# EAGLE design ethero_v4 (EAGLE 6.4)
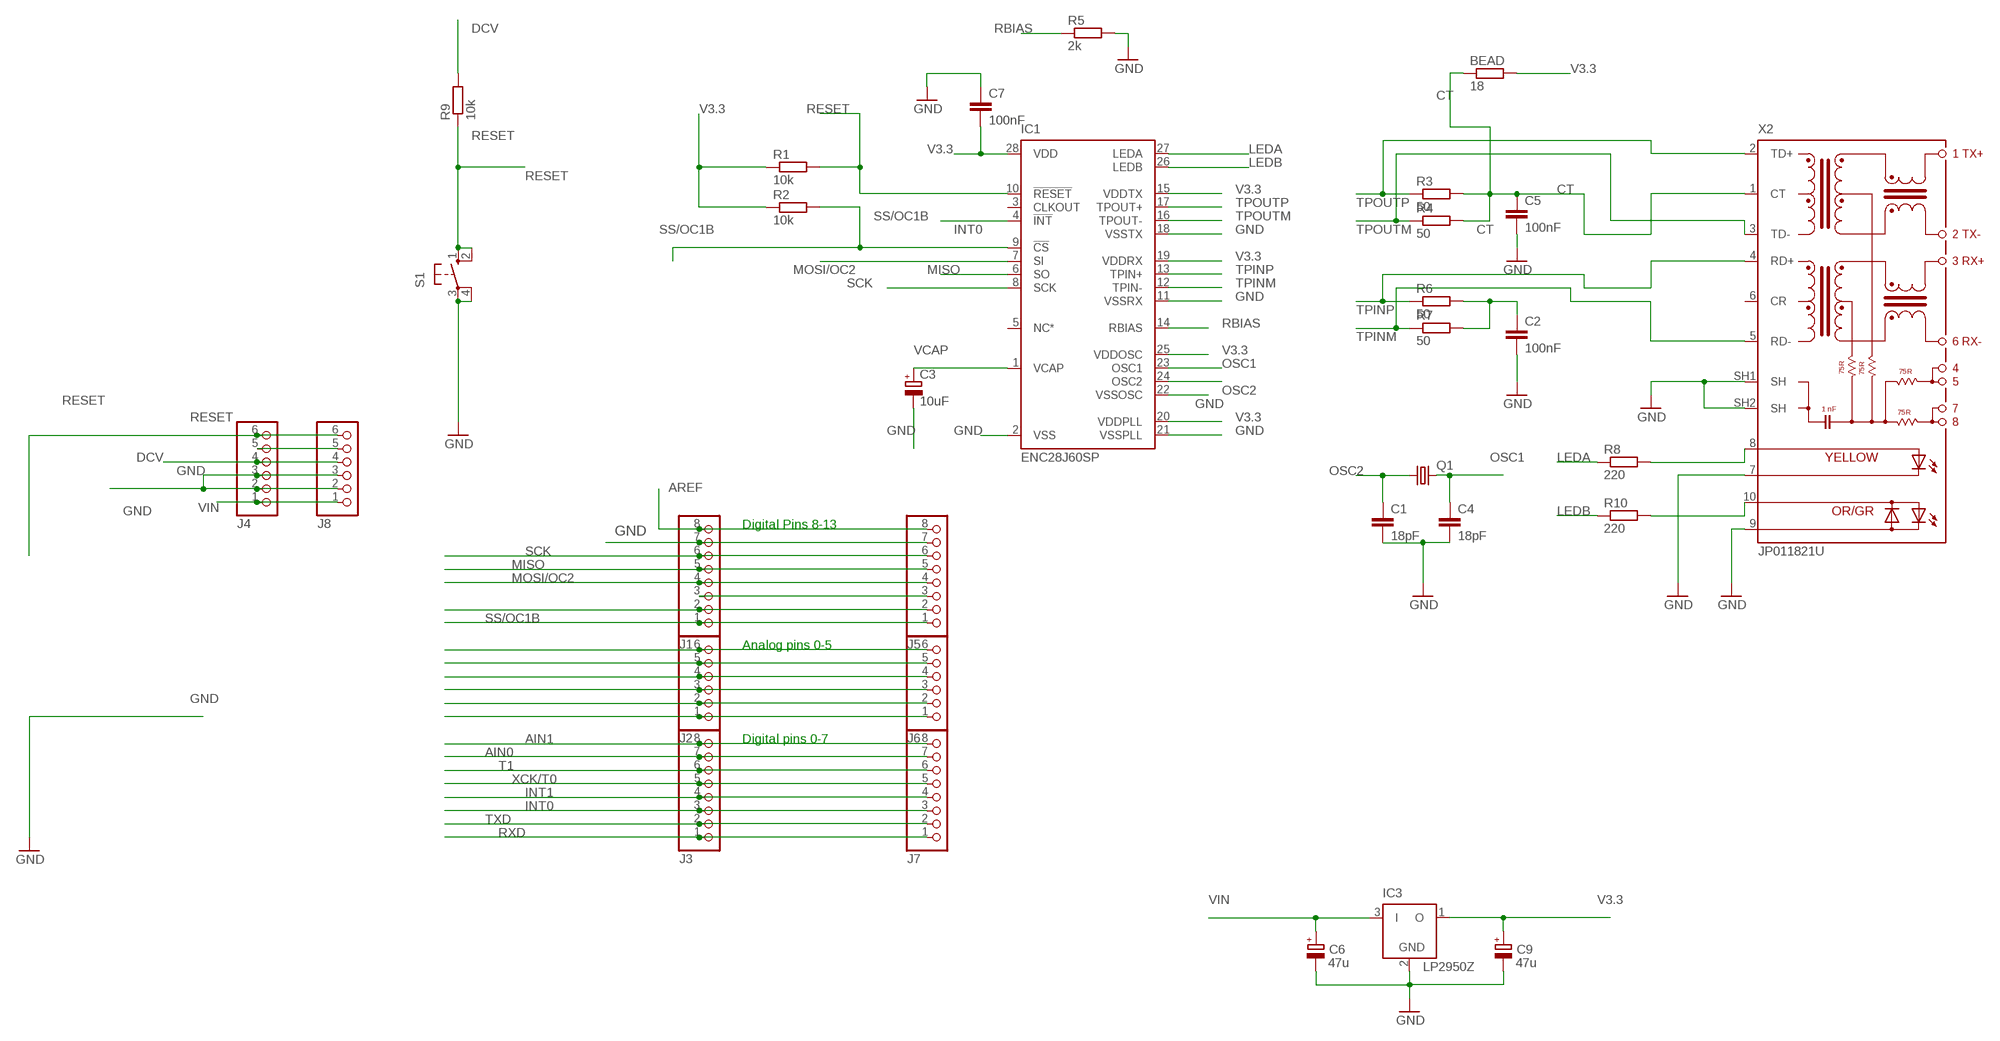
[diagram p0: schematic, sheet 1]

## Parts
BEAD  18  R-EU_0204/7  [0204/7]
C1  18pF  C-EU025-025X050  [C025-025X050]
C2  100nF  C-EU025-025X050  [C025-025X050]
C3  10uF  CPOL-EUE5-5  [E5-5]
C4  18pF  C-EU025-025X050  [C025-025X050]
C5  100nF  C-EU025-025X050  [C025-025X050]
C6  47u  CPOL-EUE3.5-8  [E3,5-8]
C7  100nF  C-EU025-025X050  [C025-025X050]
C9  47u  CPOL-EUE3.5-8  [E3,5-8]
IC1  ENC28J60SP  [DIL28-3]
IC3  LP2950Z  [TO92]
J1  PINHD-1X8  [1X08]
J2  PINHD-1X6  [1X06]
J3  PINHD-1X8  [1X08]
J4  PINHD-1X6  [1X06]
J5  PINHD-1X8  [1X08]
J6  PINHD-1X6  [1X06]
J7  PINHD-1X8  [1X08]
J8  PINHD-1X6  [1X06]
Q1  CRYSTALHC18U-V  [HC18U-V]
R1  10k  R-EU_0204/7  [0204/7]
R2  10k  R-EU_0204/7  [0204/7]
R3  50  R-EU_0204/7  [0204/7]
R4  50  R-EU_0204/7  [0204/7]
R5  2k  R-EU_0204/7  [0204/7]
R6  50  R-EU_0204/7  [0204/7]
R7  50  R-EU_0204/7  [0204/7]
R8  220  R-EU_0204/7  [0204/7]
R9  10k  R-EU_0204/7  [0204/7]
R10  220  R-EU_0204/7  [0204/7]
S1  10-XX  [B3F-10XX]
X2  JP011821U  [JP]

## Nets
AIN0: J3.7 J7.7
AIN1: J3.8 J7.8
AREF: J1.8 J5.8
CT: BEAD.1 C5.1 R3.2 R4.2 X2.1(CT)
DCV [power]: J4.4 J8.4 R9.2
GND [power]: C1.2 C2.2 C3.- C4.2 C5.2 C6.- C7.1 C9.- IC1.2(VSS) IC1.11(VSSRX) IC1.18(VSSTX) IC1.21(VSSPLL) IC1.22(VSSOSC) IC3.2(GND) J1.7 J4.2 J4.3 J5.7 J8.2 J8.3 R5.2 S1.3(P) S1.4(P1) X2.7(C-Y) X2.9(A-O_C-G) X2.SH1(SH) X2.SH2(SH)
INT0: IC1.4(!INT) J3.3 J7.3
INT1: J3.4 J7.4
LEDA: IC1.27(LEDA) R8.1
LEDB: IC1.26(LEDB) R10.1
MISO: IC1.6(SO) J1.5 J5.5
MOSI/OC2: IC1.7(SI) J1.4 J5.4
N$2: J1.2 J5.2
N$3: J4.5 J8.5
N$5: C2.1 R6.2 R7.2
N$6: J1.3 J5.3
N$10: R8.2 X2.8(A-Y)
N$12: R10.2 X2.10(C-O_A-G)
N$16: J2.1 J6.1
N$17: J2.2 J6.2
N$18: J2.3 J6.3
N$19: J2.4 J6.4
N$20: J2.5 J6.5
N$21: J2.6 J6.6
OSC1: C4.1 IC1.23(OSC1) Q1.2
OSC2: C1.1 IC1.24(OSC2) Q1.1
RBIAS: IC1.14(RBIAS) R5.1
RESET: IC1.10(!RESET) J4.6 J8.6 R1.2 R9.1 S1.1(S) S1.2(S1)
RXD: J3.1 J7.1
SCK: IC1.8(SCK) J1.6 J5.6
SS/OC1B: IC1.9(!CS) J1.1 J5.1 R2.2
T1: J3.6 J7.6
TPINM: IC1.12(TPIN-) R7.1 X2.5(RD-)
TPINP: IC1.13(TPIN+) R6.1 X2.4(RD+)
TPOUTM: IC1.16(TPOUT-) R4.1 X2.3(TD-)
TPOUTP: IC1.17(TPOUT+) R3.1 X2.2(TD+)
TXD: J3.2 J7.2
V3.3: BEAD.2 C7.2 C9.+ IC1.15(VDDTX) IC1.19(VDDRX) IC1.20(VDDPLL) IC1.25(VDDOSC) IC1.28(VDD) IC3.1(O) R1.1 R2.1
VCAP: C3.+ IC1.1(VCAP)
VIN [power]: C6.+ IC3.3(I) J4.1 J8.1
XCK/T0: J3.5 J7.5
Unconnected: IC1.3(CLKOUT) IC1.5(NC*) X2.6(CR)

## Notes on the sheet
- Digital Pins 8-13
- Analog pins 0-5
- Digital pins 0-7

## Library data of the parts
BEAD R1-R10 = resistor:R-EU_: RESISTOR, European symbol
C1 C2 C4 C5 C7 = resistor:C-EU: CAPACITOR, European symbol
C3 C6 C9 = rcl:CPOL-EU: POLARIZED CAPACITOR, European symbol
IC1 = microchip:ENC28J60: Stand-Alone Ethernet Controller with SPI Interface Source: http://ww1.microchip.com/downloads/en/DeviceDoc/39662c.pdf; MF: MICROCHIP; MPN: ENC28J60/SP; OC_FARNELL: 1084619; OC_NEWARK: 96K3661
IC3 = linear:LP2950: 100 mA, Low Power Low Dropout Voltage Regulator Source: http://www.onsemi.com/pub/Collateral/LP2950-D.PDF
J1 J3 J5 J7 = pinhead:PINHD-1X8: PIN HEADER
J2 J4 J6 J8 = pinhead:PINHD-1X6: PIN HEADER
Q1 = crystal:CRYSTAL: CRYSTAL; OC_FARNELL: unknown; OC_NEWARK: unknown
S1 = switch-omron:10-XX: OMRON SWITCH; MPN: B3F-1000; OC_FARNELL: 176432; OC_NEWARK: 36M3542
X2 = con-pulse:JP011821U: PULSEJACK (TM) 1x1 Tab-UP RJ45 10/100 Base-TX RJ45 1x1 Tab-UP with LEDs 8-pin (J1 series) and 6-pin (JP series) integrated magnetics connector, designed to support applications, such as ADSL modems, LAN-on-Motherboard, and Hub and Switches. Source: www.pulseeng.com .. PulseJack-J402.pdf; OC_FARNELL: unknown; OC_NEWARK: unknown

## Net classes
0 default: width 0.203 mm, clearance 0.203 mm
1 power: width 0.6 mm, clearance 0.305 mm
2 finepitch: width 0.203 mm, clearance 0.203 mm

## Board
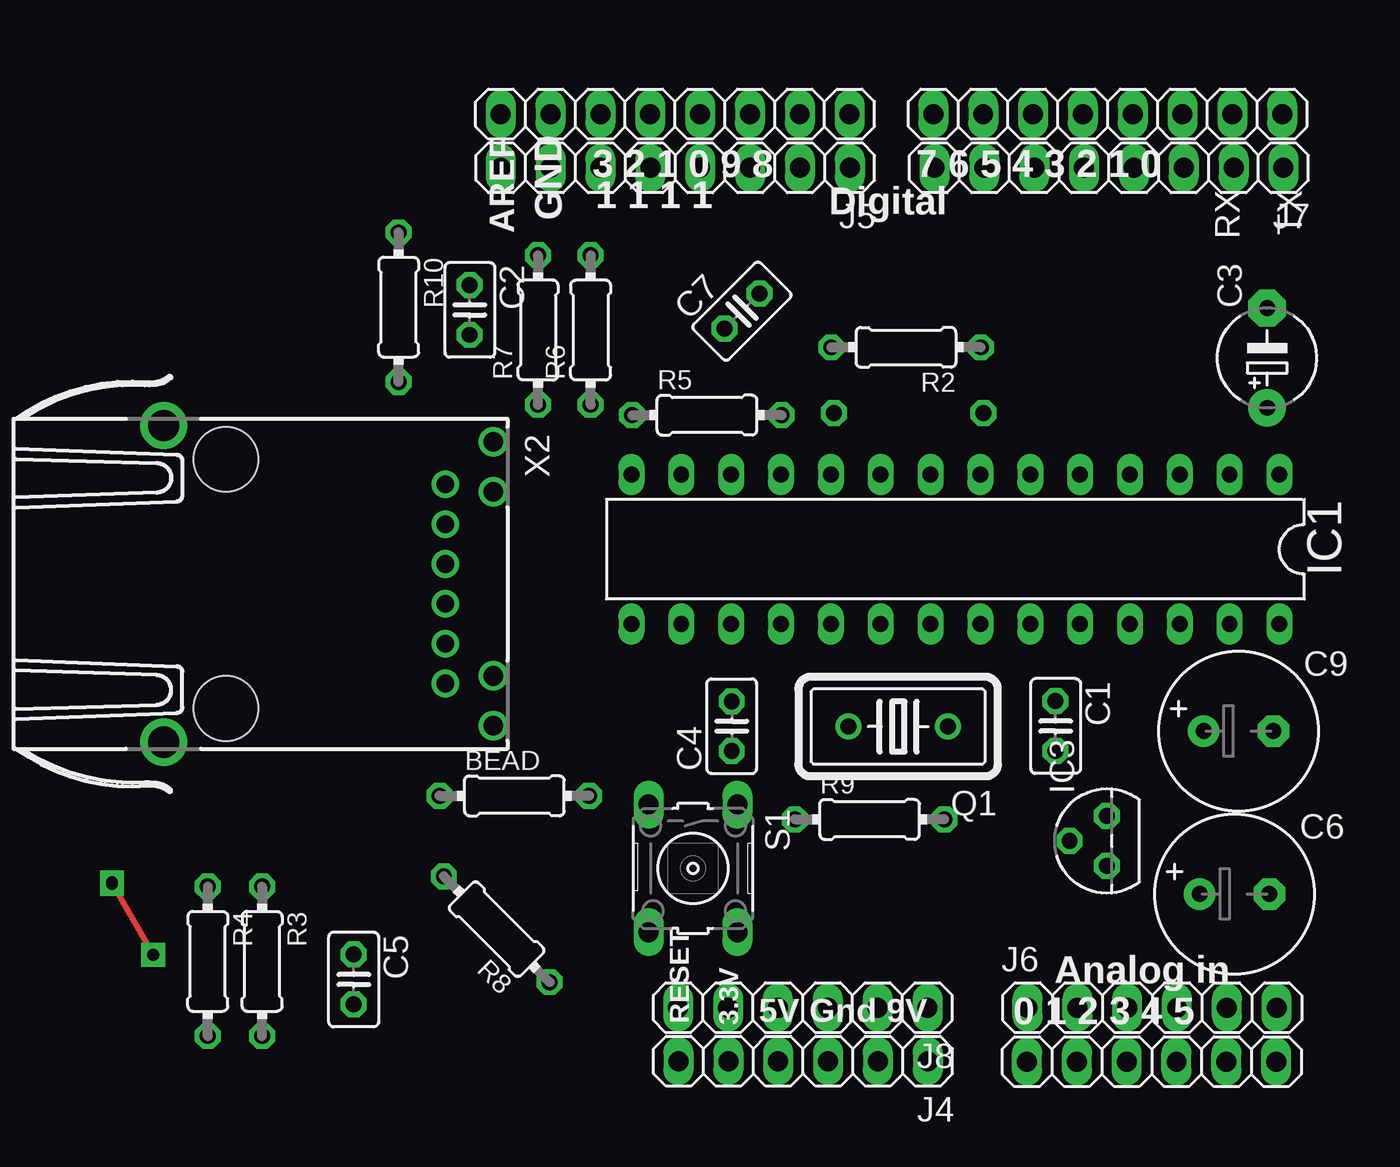
[diagram p1: board, top side]
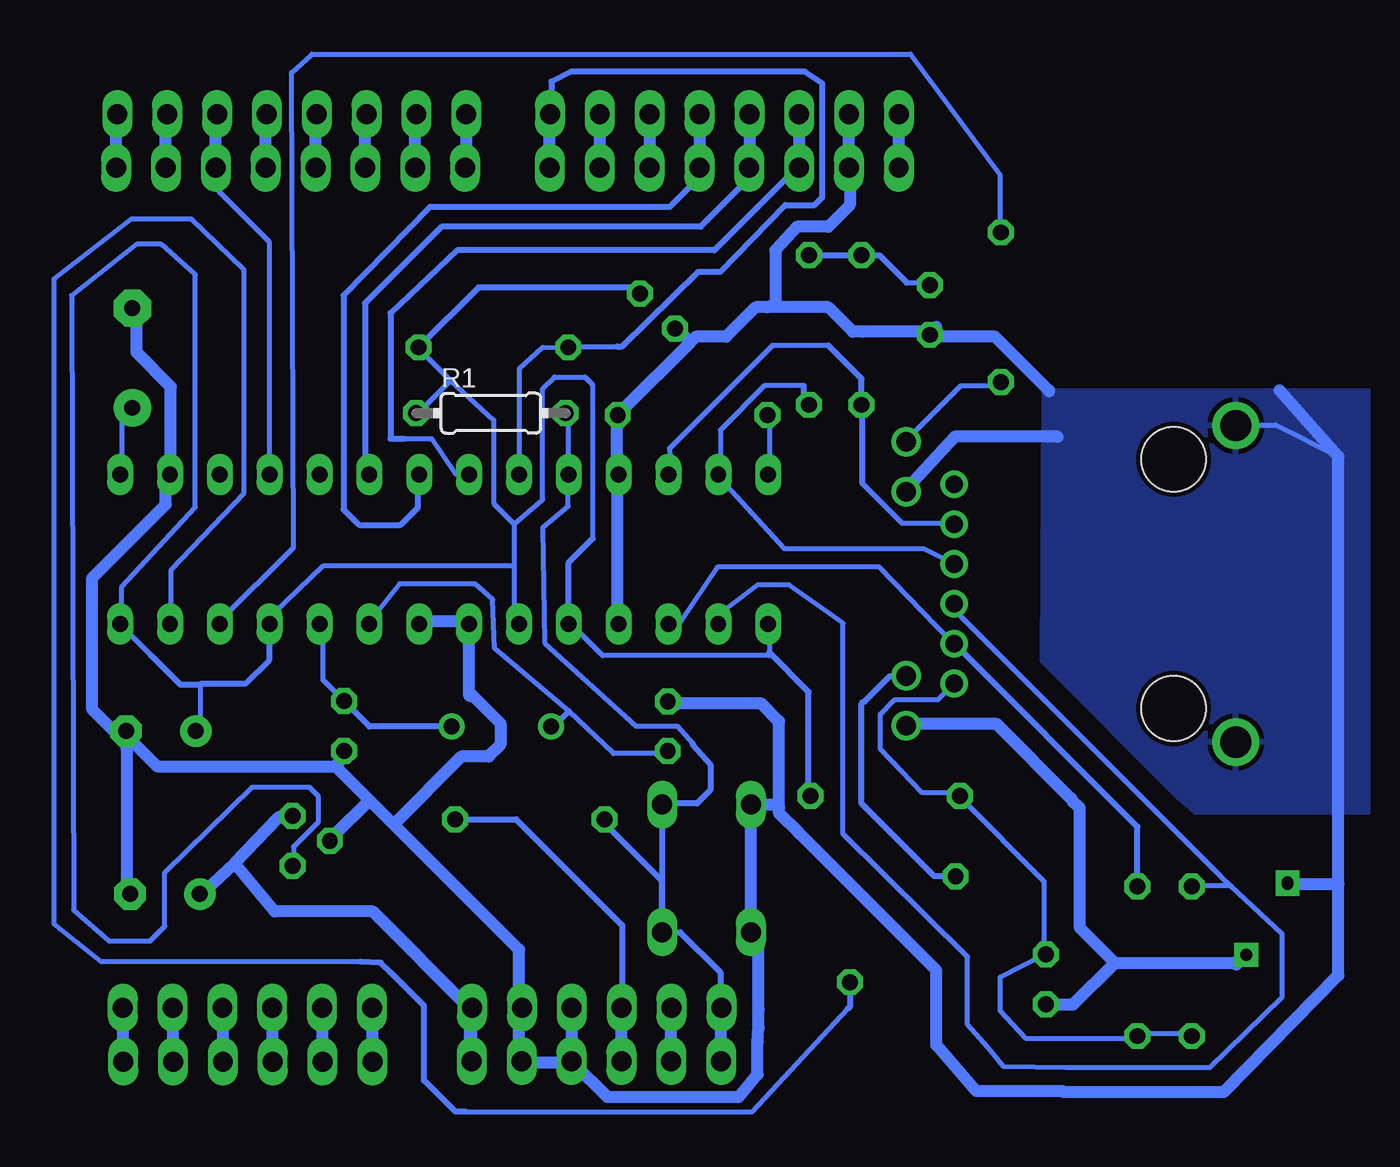
[diagram p2: board, bottom side, seen from below]

No outline drawn. Coordinates in mm, seen from the top.
Copper layers (1*16): Top 0.035mm / dielectric 1.5mm / Bottom 0.035mm
Design rules "default *": minimum track width 10mil, minimum drill 0.6mm, track to track 12mil, track to pad 12mil, pad to pad 12mil, via to via 12mil, smd to smd 12mil, copper to edge 10mil, drill to drill 15mil, minimum pad ring 10mil, minimum via ring 12mil, stop-mask expansion 4mil, vias tented up to drill 0mil, thermal gap 10mil
tRestrict: area 13.4,48.9 to 17.2,52.7; area 64.2,33.6 to 68,37.4; area 64.2,5.7 to 68,9.5; 10 lines
bRestrict: area 13.4,48.9 to 17.2,52.7; area 64.2,33.6 to 68,37.4; area 64.2,5.7 to 68,9.5; 8 lines

### Footprints (pad centres in the part's own frame; a part is rotated, then mirrored left to right if it is on the bottom)
0204/7 = drill 0.813 octagon: 1 -3.81,0; 2 3.81,0
C025-025X050 = drill 0.813 octagon: 1 -1.27,0; 2 1.27,0
E5-5 = drill 0.813 pad 1.905: + -2.54,0 | drill 0.813 pad 1.905 octagon: - 2.54,0
E3,5-8 = drill 0.813 pad 1.6: + -1.778,0 | drill 0.813 pad 1.6 octagon: - 1.778,0
DIL28-3 = drill 0.813 long: 1 -16.51,-3.81; 2 -13.97,-3.81; 3 -11.43,-3.81; 4 -8.89,-3.81; 5 -6.35,-3.81; 6 -3.81,-3.81; 7 -1.27,-3.81; 8 1.27,-3.81; 9 3.81,-3.81; 10 6.35,-3.81; 11 8.89,-3.81; 12 11.43,-3.81; 13 13.97,-3.81; 14 16.51,-3.81; 15 16.51,3.81; 16 13.97,3.81; 17 11.43,3.81; 18 8.89,3.81; 19 6.35,3.81; 20 3.81,3.81; 21 1.27,3.81; 22 -1.27,3.81; 23 -3.81,3.81; 24 -6.35,3.81; 25 -8.89,3.81; 26 -11.43,3.81; 27 -13.97,3.81; 28 -16.51,3.81
TO92 = drill 0.813 octagon: 1 -1.27,0; 2 0,1.905; 3 1.27,0
1X08 = drill 1.016 long: 1 -8.89,0; 2 -6.35,0; 3 -3.81,0; 4 -1.27,0; 5 1.27,0; 6 3.81,0; 7 6.35,0; 8 8.89,0
1X06 = drill 1.016 long: 1 -6.35,0; 2 -3.81,0; 3 -1.27,0; 4 1.27,0; 5 3.81,0; 6 6.35,0
HC18U-V = drill 0.813: 1 -2.54,0; 2 2.54,0
B3F-10XX = drill 1.016 long: 1 -3.251,2.261; 2 3.251,2.261; 3 -3.251,-2.261; 4 3.251,-2.261
JP = drill 0.9 pad 1.3: 1 5.075,11.18; 2 3.045,11.18; 3 1.015,11.18; 4 -1.015,11.18; 5 -3.045,11.18; 6 -5.075,11.18 | drill 1 pad 1.4: 7 7.23,13.62; 8 4.69,13.62; 9 -4.69,13.62; 10 -7.23,13.62 | drill 1.6 pad 2.184: SH1 -8.065,-3.17; SH2 8.065,-3.17 | hole 3.3: 6.35,0; -6.35,0

### Placement (x,y rotation side)
BEAD  24.6,16.1 0 top
C1  52.18,19.65 270 top
C2  22.33,40.86 270 top
C3  62.96,38.41 90 top
C4  35.68,19.65 90 top
C5  16.41,6.74 270 top
C6  61.3,11.1 0 top
C7  36.2,40.8 45 top
C9  61.5,19.4 0 top
IC1  47.07,28.66 180 top
IC3  54.8,13.8 90 top
J1  32.79,50.84 180 top
J2  57.07,2.55 0 top
J3  54.84,50.84 180 top
J4  39.31,2.58 180 top
J5  32.8,48.1 180 top
J6  57.1,5.3 0 top
J7  54.9,48.1 180 top
J8  39.3,5.3 180 top
Q1  44.15,19.63 180 top
R1  44.69,35.6 0 bottom
R2  44.56,38.95 180 top
R3  11.74,7.67 270 top
R4  8.98,7.67 270 top
R5  34.41,35.5 0 top
R6  28.49,39.83 90 top
R7  25.81,39.83 90 top
R8  23.7,9.3 135 top
R9  42.7,14.9 0 top
R10  18.7,41 270 top
S1  33.7,12.4 270 top
X2  9.9,26.9 270 top

### Tracks (layer width: path | path; a pad name or v marks a point on that pad's centre or on a via)
AIN0
  Bottom 0.61: J7.7 48.55,50.78 J3.7
AIN1
  Bottom 0.61: J3.8 45.95,48.16 J7.8
AREF
  Bottom 0.61: J5.8 J1.8
CT
  Bottom 0.254: X2.1 21.25,21.75 21.15,21.75 21.9,21 24.1,21 24.85,20.25 24.85,18.5 22.7,16.25 21,16.25 BEAD.1 20.75,16 16.5,11.75 16.5,8.25 C5.1 16.5,8 18.75,6.85 18.75,5.15 17.45,3.75 11.75,3.75 R3.2 11.5,4 9,4 R4.2
DCV
  Bottom 0.305: R9.2 43.4,14.9 38,9.5 38,5.33 J8.4
  Bottom 0.61: J4.4 38.04,5.29 J8.4
GND  (via drill 0.6)
  Top 0.305: v4.1,11.6 v6.2,8
  Bottom 0.254: X2.SH1 5.74,34.97 5.7,35 4.7,35 1.5,33.4 | X2.7 22.07,19.67 22,19.6
  Bottom 0.305: IC1.18 38.18,35.52
  Bottom 0.6: IC1.18 38.25,25 38.25,32.25 IC1.11 38.25,32.75 38.25,35.25 R5.2 38,35.75 34.52,39.23 34.25,39.5 | C2.2 22.25,39.5 19,39.5 16.25,36.75 16.25,36.7 | 18.9,19.75 23.5,19.75 X2.7 | 15.8,34.4 21.05,34.4 23.5,31.75 X2.9 | 25.75,39.75 22.5,39.75 C2.2 | 61,32.5 IC1.2 | 61.25,32.25 IC1.2 | C1.2 52,18.25 52.62,17.62 50.88,15.88 | IC1.22 48.25,25 46,25 IC1.21 45.75,24.75 | 35.25,20.75 35.5,20.75 C4.2 | 31.05,5.2 31.05,4.3 31.1,3.55 31.1,1.9 32.05,0.75 38.75,0.75 40.5,2.5 J4.3 40.75,2.5 43,2.5 J4.2 43.25,2.75 | 43.5,8.5 49.65,14.65 50.88,15.88 | 22,40 22.25,39.75 C2.2 | 4.5,36.75 1.5,33.4 1.5,11.6 1.5,6.95 7.35,1 15.5,1 15.55,1.05 19.95,1.05 22,3.4 22,7.2 29,14.2 | 53,13.75 IC3.2 52.75,14 50.88,15.88 | 63.25,18.75 C9.- | C6.- 63.25,10.9 63.25,18.5 C9.- | IC1.2 61.25,32 61.25,30.95 65,27.2 65,20.5 63.5,19 C9.- | C3.- 62.75,40.75 62.75,38.7 61,36.95 61,32.75 IC1.2
  Bottom 0.61: 18.9,19.75 15.1,15.95 15.1,15.9 14.7,15.5 14.7,9.4 12.9,7.6 | v6.2,8 6.7,7.5 6.8,7.6 12.9,7.6 | v4.1,11.6 1.5,11.6 | 29,14.2 30,15.2 30,15.5 | 30,15.5 30,19.9 30.9,20.8 35.56,20.8 C4.2 | IC1.21 45.8,21.2 45.6,21.2 44.2,19.8 44.2,18.7 44.8,18.1 46.2,18.1 49.65,14.65 | 43.25,5.16 43.25,8.25 43.5,8.5 | 31.05,5.2 31.05,8.84 S1.4 S1.3 30.15,15.65 30,15.5 | J8.3 40.57,2.59 J4.3 | J1.7 J5.7 26.4,48.05 26.4,46.2 27.5,45.1 29.1,45.1 30.2,43.9 30.2,41.1 30.6,41 | 25.75,39.75 26.25,39.75 27.5,41 30.6,41 | 30.6,41 31.2,41 32.7,39.5 34.25,39.5 | C7.1 35.2,39.9 34.52,39.23 | 43.25,2.75 43.25,5.16 | 43.25,5.16 J8.2 | 63.25,18.75 62.85,18.75 61.7,17.6 52.65,17.6 52.62,17.62 | C5.2 15.03,5.47 12.9,7.6
  pour Bottom: 0,15.3 0,36.7 16.5,36.7 16.5,36.3 16.6,23 9.7,16.1 8.8,15.3
INT0
  Bottom 0.254: 58.5,46.85 56,44.35 56,32.5 IC1.4
  Bottom 0.305: 58.5,46.85 58.5,47.89
  Bottom 0.61: 58.5,47.89 J7.3 58.71,50.78 J3.3
INT1
  Bottom 0.61: J7.4 56.17,50.78 J3.4
LEDA
  Bottom 0.254: 46,0 31.35,0 26.5,5.25 | 51.35,7.65 64.55,7.65 66.95,9.55 66.95,42.45 63,45.5 59.95,45.5 57.3,42.95 57.3,31.5 61,27.6 61,25 IC1.27
  Bottom 0.305: 46,0 46.5,0 48.1,1.6 48.1,5.4 49.8,7.1 50.3,7.6 51.35,7.65 | R8.1 26.39,5.36 26.5,5.25
LEDB
  Bottom 0.254: R10.1 18.75,45 18.75,47.75 23.3,53.9 53.8,53.9 54.85,52.95 54.75,28.75 58.5,25 IC1.26
MISO
  Bottom 0.305: J5.5 31.63,47.47 34,45.1 47.2,45.1 51.1,41.2 51.1,32.69 IC1.6
  Bottom 0.61: J1.5 J5.5
MOSI/OC2
  Bottom 0.305: J5.4 34.07,47.63 35.6,46.1 47.8,46.1 52.2,41.6 52.2,30.7 51.4,29.9 49.3,29.9 48.4,30.8 48.4,32.42 IC1.7
  Bottom 0.61: J1.4 J5.4
N$1  (via drill 0.6)
  other vias: 4.1,11.7
N$2
  Bottom 0.61: J1.2 J5.2
N$3
  Bottom 0.61: J4.5 35.5,5.29 J8.5
N$5
  Bottom 0.254: 23.5,42.25 22.5,42.25 C2.1
  Bottom 0.305: R6.2 R7.2 24.89,43.64 23.5,42.25
N$6
  Bottom 0.61: J1.3 J5.3
N$10
  Bottom 0.254: 24.35,22.2 X2.8
  Bottom 0.305: R8.2 22.09,11.99 25.8,15.7 25.8,20.8 25.7,20.9 25.65,20.9 24.35,22.2
N$12
  Bottom 0.254: R10.2 18.75,37 20.75,37 23.5,34.25 X2.10
N$16
  Bottom 0.61: J2.1 50.72,5.27 J6.1
N$17
  Bottom 0.61: J2.2 53.26,5.27 J6.2
N$18
  Bottom 0.61: J2.3 55.8,5.27 J6.3
N$19
  Bottom 0.61: J2.4 58.34,5.27 J6.4
N$20
  Bottom 0.61: J2.5 60.88,5.27 J6.5
N$21
  Bottom 0.61: J2.6 63.42,5.27 J6.6
OSC1
  Bottom 0.254: C4.1 35.75,18.25 38.45,18.25 40.72,20.4 44.5,23.6 44.6,26.1 45.5,26.9 49.35,26.9 50.85,25 50.75,25 IC1.23
  Bottom 0.305: Q1.2 41.49,19.63 40.72,20.4
OSC2
  Bottom 0.254: 52,20.75 C1.1 52.25,21 53.25,22 53.25,24.75 IC1.24
  Bottom 0.305: Q1.1 50.88,19.63 C1.1
RBIAS
  Bottom 0.254: IC1.14 30.5,32.5 30.5,35.25 R5.1
RESET
  Bottom 0.254: R1.2 40.75,35.5 40.75,32.5 IC1.10 40.75,30.85 42.05,29.75 41.95,23.9 37.3,19.65 35.2,19.65 34.4,18.75
  Bottom 0.305: R9.1 38.89,14.69 36,11.8 36,9.19 S1.2 | S1.2 35.05,9.15 33,7.1 33,5.35 J8.6 | S1.2 S1.1 35.91,15.7 34.2,15.7 33.5,16.4 33.5,17.7 34.4,18.7 34.4,18.75
  Bottom 0.61: J4.6 32.96,5.29 J8.6
RXD
  Bottom 0.61: J7.1 63.79,50.78 J3.1
SCK
  Bottom 0.254: 49.1,34.3 47.7,34.3 46.5,32.5 46,32.5 IC1.8
  Bottom 0.305: J5.6 29.1,48.1 33.3,43.9 46.4,43.9 49.8,40.7 49.8,34.3 49.1,34.3
  Bottom 0.61: J1.6 J5.6
SS/OC1B
  Bottom 0.254: IC1.9 43.25,32.5 43.25,37.85 42.05,38.95 R2.2 40.5,39 38.25,39
  Bottom 0.305: J1.1 41.6,50.82 41.6,52.5 40.6,53 28.7,53 27.8,52.4 27.8,46.6 28.2,46.2 29.7,46.2 33,42.8 34.1,42.8 38,39 38.25,39
  Bottom 0.61: J5.1 41.7,50.82 J1.1
T1
  Bottom 0.61: J7.6 51.09,50.78 J3.6
TPINM
  Bottom 0.254: 27.5,39.05 30.35,39.05 35.6,33.8 35.5,32.5 IC1.12 | 25.75,32 23.75,30 21.25,30 X2.5
  Bottom 0.305: 25.75,32 25.75,35.97 R7.1 25.81,37.36 27.5,39.05
TPINP
  Bottom 0.254: 28.75,37 30.75,37 33,34.75 33,32.5 IC1.13 33,32.25 29.75,28.7 22.65,28.7 X2.4
  Bottom 0.305: 28.75,37 28.75,36.29 R6.1
TPOUTM
  Bottom 0.254: 6.98,11.52 7.5,12 21.25,25.75 X2.3 | 6.98,11.52 4.4,9.1 4.4,5.8 8.05,2.25 15.4,2.25 18.55,2.3 19.35,3.25 20.4,4.45 20.4,7.9 26.75,14.15 26.75,24.9 29.5,26.85 31.1,26.85 33.15,25.3 33,25 IC1.16 | R4.1 8.75,11.5 7,11.5 6.98,11.52
TPOUTP
  Bottom 0.254: IC1.17 35.5,25 35,25 33.15,27.75 24.9,27.75 21.25,24 X2.2
  Bottom 0.305: X2.2 11.74,14.52 R3.1
TXD
  Bottom 0.61: J7.2 61.25,50.78 J3.2
V3.3
  Bottom 0.254: IC1.15 30.5,24.75 30.5,23.4 30.5,23.25 39,23.25 40.5,24.75 IC1.19 | 56,24.75 IC1.25 55.75,25 55.75,25.4 53.25,27.8 43.5,27.8 | 43.5,29.95 43.5,27.8 | 43.5,27.8 43.5,25 IC1.20 | 43.5,29.95 44.55,31 44.55,35.25 46.75,37.25 | 46.75,37.25 48.25,38.75 R2.1 | 46.75,37.25 48.25,35.75 R1.1 | 39.5,29.2 39.5,37.05 39.9,37.45 41.45,37.45 42.05,36.85 42.05,31.2 43.5,29.95 | 59.5,21.75 59.5,19.6 C9.+ | IC3.1 54.75,12.75 54.75,13.5 53.5,14.75 53.5,16.1 53.95,16.55 56.85,16.55 61.3,12.2 61.3,9.45 62.05,8.7 64.15,8.7 65.95,10.3 66.05,41.6 62.75,44.2 61.5,44.2 59.75,42.65 59.75,30.8 63.5,26.75 63.5,25 IC1.28 63.5,24.75 62,23.25 | 28.5,16.25 BEAD.2
  Bottom 0.305: 28.5,16.25 28.5,21.4 30.5,23.4 | C7.2 37.4,42 45.32,42 R2.1 | 62,23.25 60.5,21.75 59.5,21.75 59.45,21.8 57.2,21.8 56,23 56,24.75 | IC1.19 40.72,27.98 39.5,29.2
VCAP
  Bottom 0.254: IC1.1 63.5,32.5 63.5,35.25 63,35.75 C3.+
VIN
  Bottom 0.6: 45.75,2.75 J4.1 | IC3.3 55,15 55.5,15 57.75,12.65 59.2,11.3 C6.+
  Bottom 0.61: 45.75,2.75 45.75,5.25 50.7,10.2 55.7,10.2 57.75,12.65 | J4.1 45.66,5.29 J8.1
XCK/T0
  Bottom 0.61: J7.5 53.63,50.78 J3.5

### Text on the board
tPlace: RESET | 3.3V
tNames: 3 2 1 0 9 8 | 7 6 5 4 3 2 1 0 | RX | TX | 1 1 1 1 | Digital | AREF | GND | Analog in | 5V Gnd 9V | 0 1 2 3 4 5
Edit History: 20070917 WestfW: Move (CC) symbol, use silk_gen to get 5mil widths | 20070917 WestfW: Manual route some, autoroute rest. Fiddle. | 20070917 WestfW: Now V1.16. Change components to TH. | 20070911 WestfW: Now V1.15. Move tracks slightly for shielding | 20070900 Daniel: Schematic and initial placement
_tsilk: C12 | C8 | 3 2 1 0 9 8 | 7 6 5 4 3 2 1 0 | RX | TX | 1 1 1 1 | Digital | X2 | AREF | GND | R7 | PWM | PWM | PWM | PWM | PWM | PWM | PWR | IC1 | 13 | Freeduino | FT232RL | c | c | R10 | V1.16 | TX | R8 | RX | 16Mhz | 1 | R1 | R9 | C3 | C10 | R12 | ]USB | R11 | ]EXT | F1 | Q1 | C2 | ICSP | RESET | 1 | CRS | M. Banzi | D. Cuartielles | D. Mellis | N. Zambetti | C5 | C4 | ATMEGA168 | IC2 | D1 | C1 | 47u | C7 | 47u | C6 | C9 | Analog in | 5V Gnd 9V | RESET | 3.3V | 0 1 2 3 4 5 | 9V in